# EAGLE schematic MCU_Module (EAGLE 9.0.0)

## Sheet 1 of 2
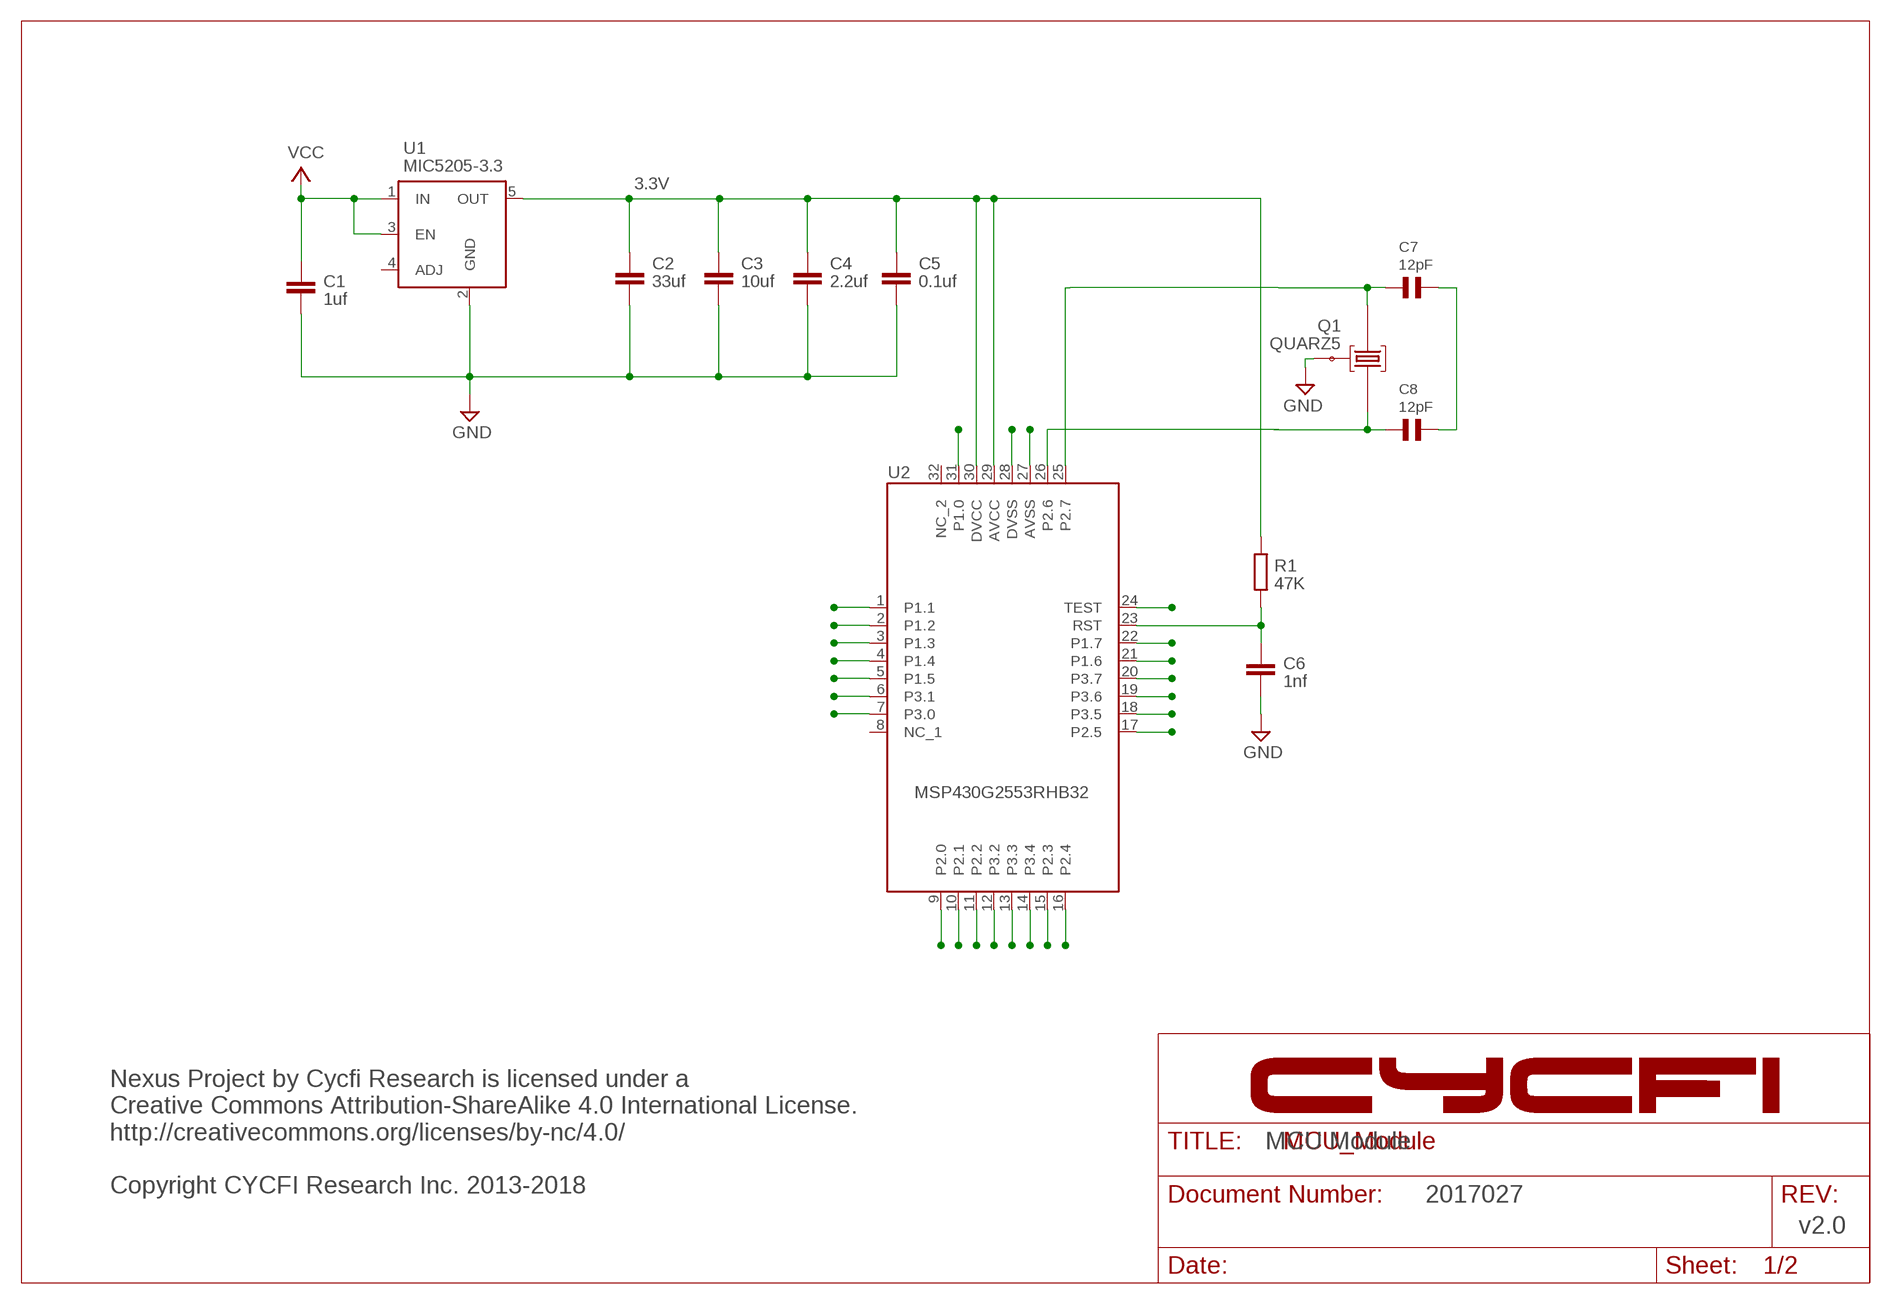
[diagram p0: schematic, sheet 1]

### Parts
C1  1uf  C-EUC0805  [C0805]
C2  33uf  C-EUC0805  [C0805]
C3  10uf  C-EUC0805  [C0805]
C4  2.2uf  C-EUC0805  [C0805]
C5  0.1uf  C-EUC0603  [C0603]
C6  1nf  C-EUC0603  [C0603]
C7  12pF  C_SMD0603  [0603]
C8  12pF  C_SMD0603  [0603]
Q1  QUARZ5  [QUARZ5]
R1  47K  R-EU_R0402  [R0402]
U1  MIC5205-3.3  MIC5219BM5  [SOT23-5]
U2  MSP430G2553RHB32  [QFN32]

### Nets
!RST: C6.1 R1.2 U2.23(RST) ; also sheet 2
DVCC(3.3V): C2.1 C3.1 C4.1 C5.1 R1.1 U1.5(OUT) U2.29(AVCC) U2.30(DVCC) ; also sheet 2
GND: C1.2 C2.2 C3.2 C4.2 C5.2 C6.2 C7.1 C8.1 Q1.GND@0 U1.2(GND) U2.27(AVSS) U2.28(DVSS) ; also sheet 2
P1.0: U2.31(P1.0) ; also sheet 2
P1.1: U2.1(P1.1) ; also sheet 2
P1.2: U2.2(P1.2) ; also sheet 2
P1.3: U2.3(P1.3) ; also sheet 2
P1.4: U2.4(P1.4) ; also sheet 2
P1.5: U2.5(P1.5) ; also sheet 2
P1.6: U2.21(P1.6) ; also sheet 2
P1.7: U2.22(P1.7) ; also sheet 2
P2.0: U2.9(P2.0) ; also sheet 2
P2.1: U2.10(P2.1) ; also sheet 2
P2.2: U2.11(P2.2) ; also sheet 2
P2.3: U2.15(P2.3) ; also sheet 2
P2.4: U2.16(P2.4) ; also sheet 2
P2.5: U2.17(P2.5) ; also sheet 2
P2.6: C8.2 Q1.1 U2.26(P2.6) ; also sheet 2
P2.7: C7.2 Q1.2 U2.25(P2.7) ; also sheet 2
P3.0: U2.7(P3.0) ; also sheet 2
P3.1: U2.6(P3.1) ; also sheet 2
P3.2: U2.12(P3.2) ; also sheet 2
P3.3: U2.13(P3.3) ; also sheet 2
P3.4: U2.14(P3.4) ; also sheet 2
P3.5: U2.18(P3.5) ; also sheet 2
P3.6: U2.19(P3.6) ; also sheet 2
P3.7: U2.20(P3.7) ; also sheet 2
TEST: U2.24(TEST) ; also sheet 2
VCC: C1.1 U1.1(IN) U1.3(EN) ; also sheet 2
Unconnected: U1.4(ADJ) U2.8(NC_1)

### Notes on the sheet
- VCC
- 3.3V
- MCU Module
- Nexus Project by Cycfi Research is licensed under a 
  Creative Commons Attribution-ShareAlike 4.0 International License.
  http://creativecommons.org/licenses/by-nc/4.0/ 
  
  Copyright CYCFI Research Inc. 2013-2018
- 2017027
- v2.0

## Sheet 2 of 2
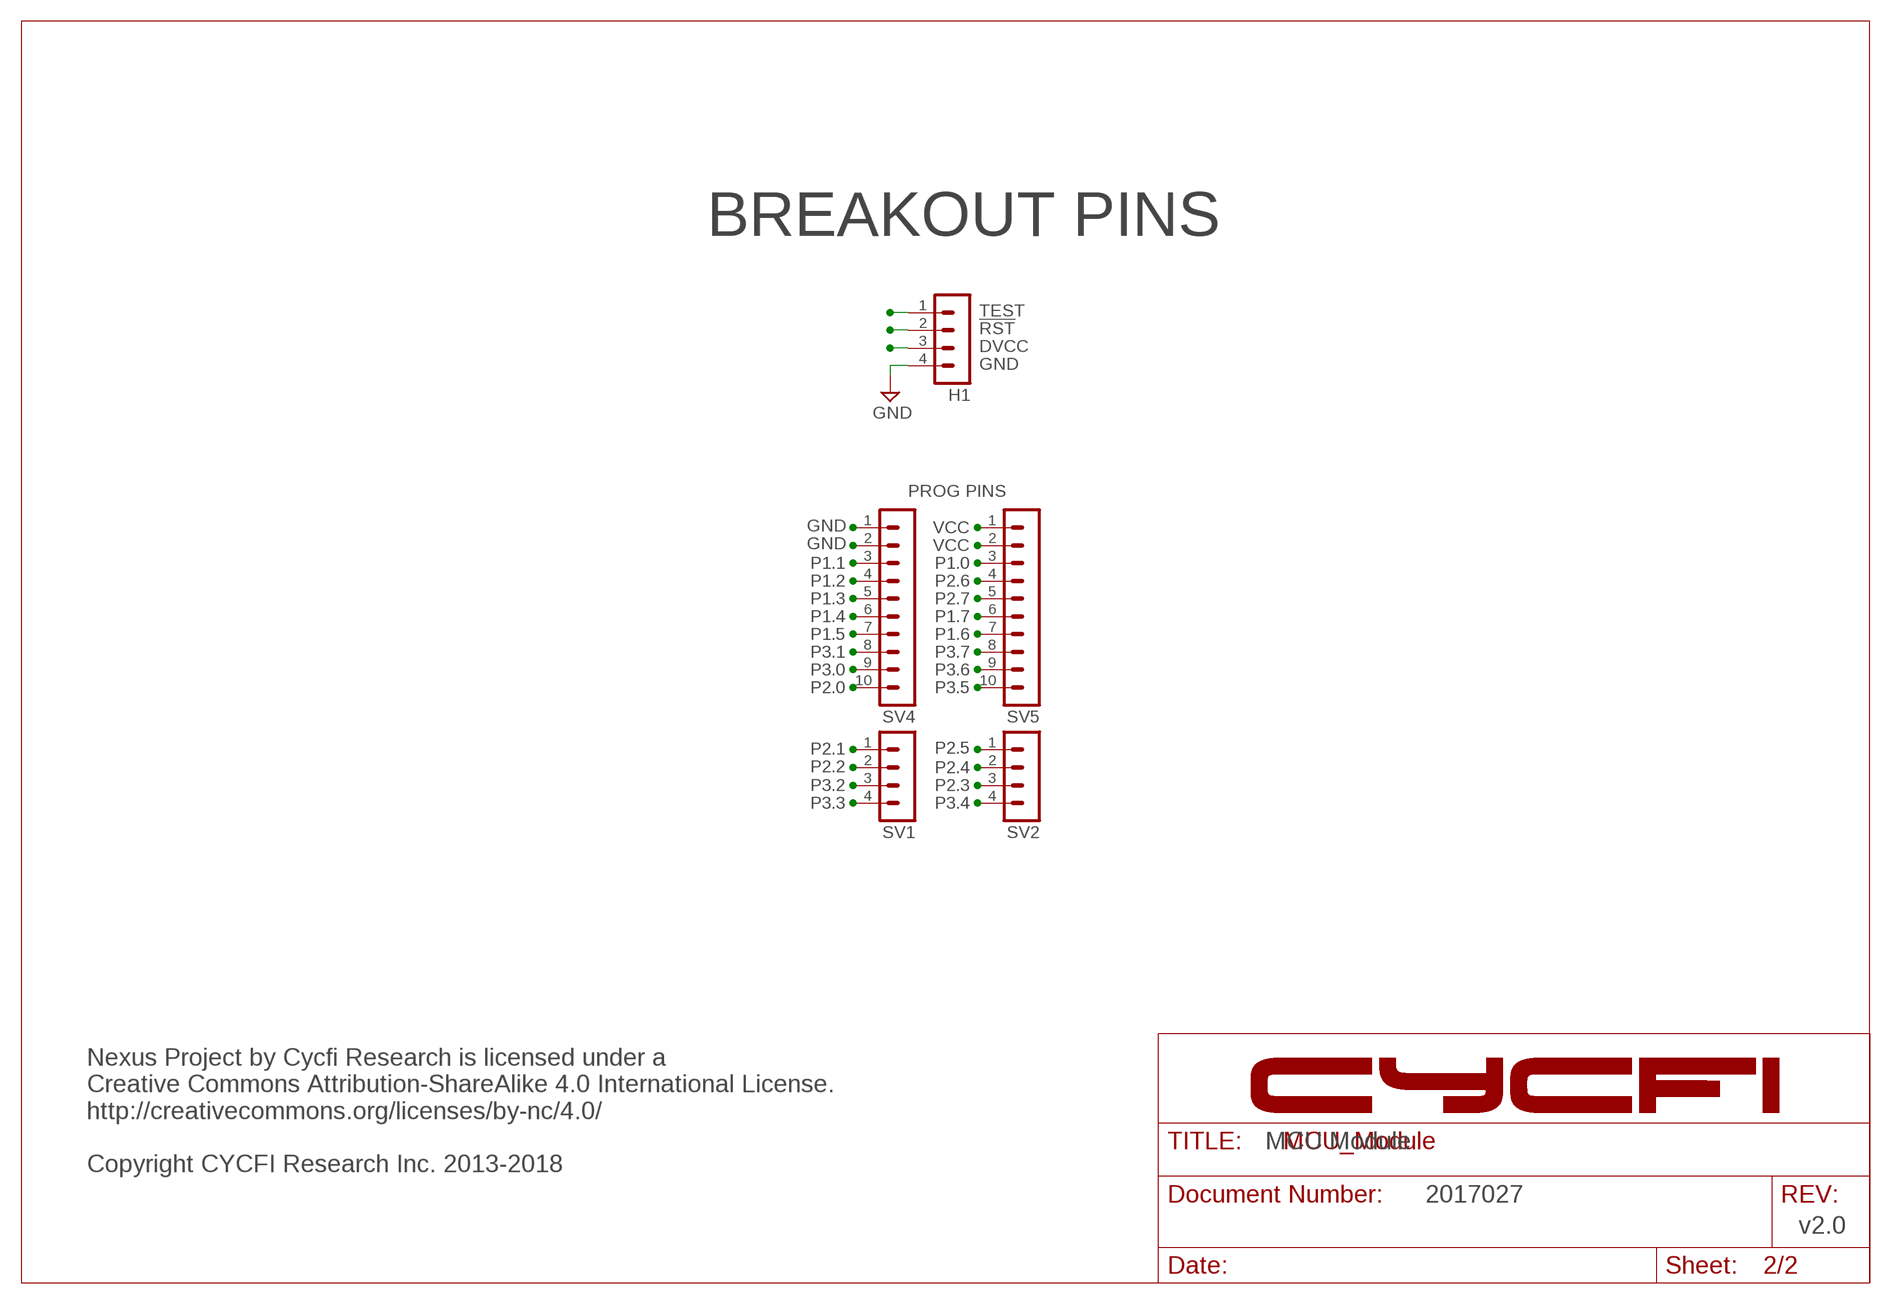
[diagram p1: schematic, sheet 2]

### Parts
H1  MA04-1  [MA04-1]
SV1  MA04-1  [MA04-1]
SV2  MA04-1  [MA04-1]
SV4  MA10-1  [MA10-1]
SV5  MA10-1  [MA10-1]

### Nets
!RST: H1.2 ; also sheet 1
DVCC(3.3V): H1.3 ; also sheet 1
GND: H1.4 SV4.1 SV4.2 ; also sheet 1
P1.0: SV5.3 ; also sheet 1
P1.1: SV4.3 ; also sheet 1
P1.2: SV4.4 ; also sheet 1
P1.3: SV4.5 ; also sheet 1
P1.4: SV4.6 ; also sheet 1
P1.5: SV4.7 ; also sheet 1
P1.6: SV5.7 ; also sheet 1
P1.7: SV5.6 ; also sheet 1
P2.0: SV4.10 ; also sheet 1
P2.1: SV1.1 ; also sheet 1
P2.2: SV1.2 ; also sheet 1
P2.3: SV2.3 ; also sheet 1
P2.4: SV2.2 ; also sheet 1
P2.5: SV2.1 ; also sheet 1
P2.6: SV5.4 ; also sheet 1
P2.7: SV5.5 ; also sheet 1
P3.0: SV4.9 ; also sheet 1
P3.1: SV4.8 ; also sheet 1
P3.2: SV1.3 ; also sheet 1
P3.3: SV1.4 ; also sheet 1
P3.4: SV2.4 ; also sheet 1
P3.5: SV5.10 ; also sheet 1
P3.6: SV5.9 ; also sheet 1
P3.7: SV5.8 ; also sheet 1
TEST: H1.1 ; also sheet 1
VCC: SV5.1 SV5.2 ; also sheet 1

### Notes on the sheet
- BREAKOUT PINS
- TEST
- !RST
- DVCC
- GND
- PROG PINS
- GND | VCC
- GND | VCC
- P1.1 | P1.0
- P1.2 | P2.6
- P1.3 | P2.7
- P1.4 | P1.7
- P1.5 | P1.6
- P3.1 | P3.7
- P3.0 | P3.6
- P2.0 | P3.5
- P2.1 | P2.5
- P2.2 | P2.4
- P3.2 | P2.3
- P3.3 | P3.4
- MCU Module
- Nexus Project by Cycfi Research is licensed under a 
  Creative Commons Attribution-ShareAlike 4.0 International License.
  http://creativecommons.org/licenses/by-nc/4.0/ 
  
  Copyright CYCFI Research Inc. 2013-2018
- 2017027
- v2.0

## Power pins joined to a net without a drawn wire
NC_2: U2.32(NC_2)

## Library data of the parts
C1-C6 = resistor:C-EU: CAPACITOR, European symbol
C7 C8 = ssmd:C_SMD
H1 SV1 SV2 = con-lstb:MA04-1: PIN HEADER; OC_FARNELL: unknown; OC_NEWARK: unknown
Q1 = sMSP430:QUARZ5
R1 = resistor:R-EU_: RESISTOR, European symbol
SV4 SV5 = con-lstb:MA10-1: PIN HEADER; OC_FARNELL: unknown; OC_NEWARK: unknown
U1 = v-reg-micrel:MIC5219BM5: VOLTAGE REGULATOR; MF: ALTERA CORPORATION; MPN: MIC5219BM5 TR; OC_FARNELL: 1100656; OC_NEWARK: 09J8939
U2 = CYCFI_IC:MSP430G2553RHB32

## Net classes
1 Ground: width 0.1 mm, drill 0.2 mm